# Altium schematic sheet I2C_SENSOR.SchDoc: I2C_SENSOR
size A3; Date: 13/11/2025; DrawnBy: Văn Quý Tuân; SheetNumber: 5; SheetTotal: 10; Subsystem: HW-11/11/25; Size: A3
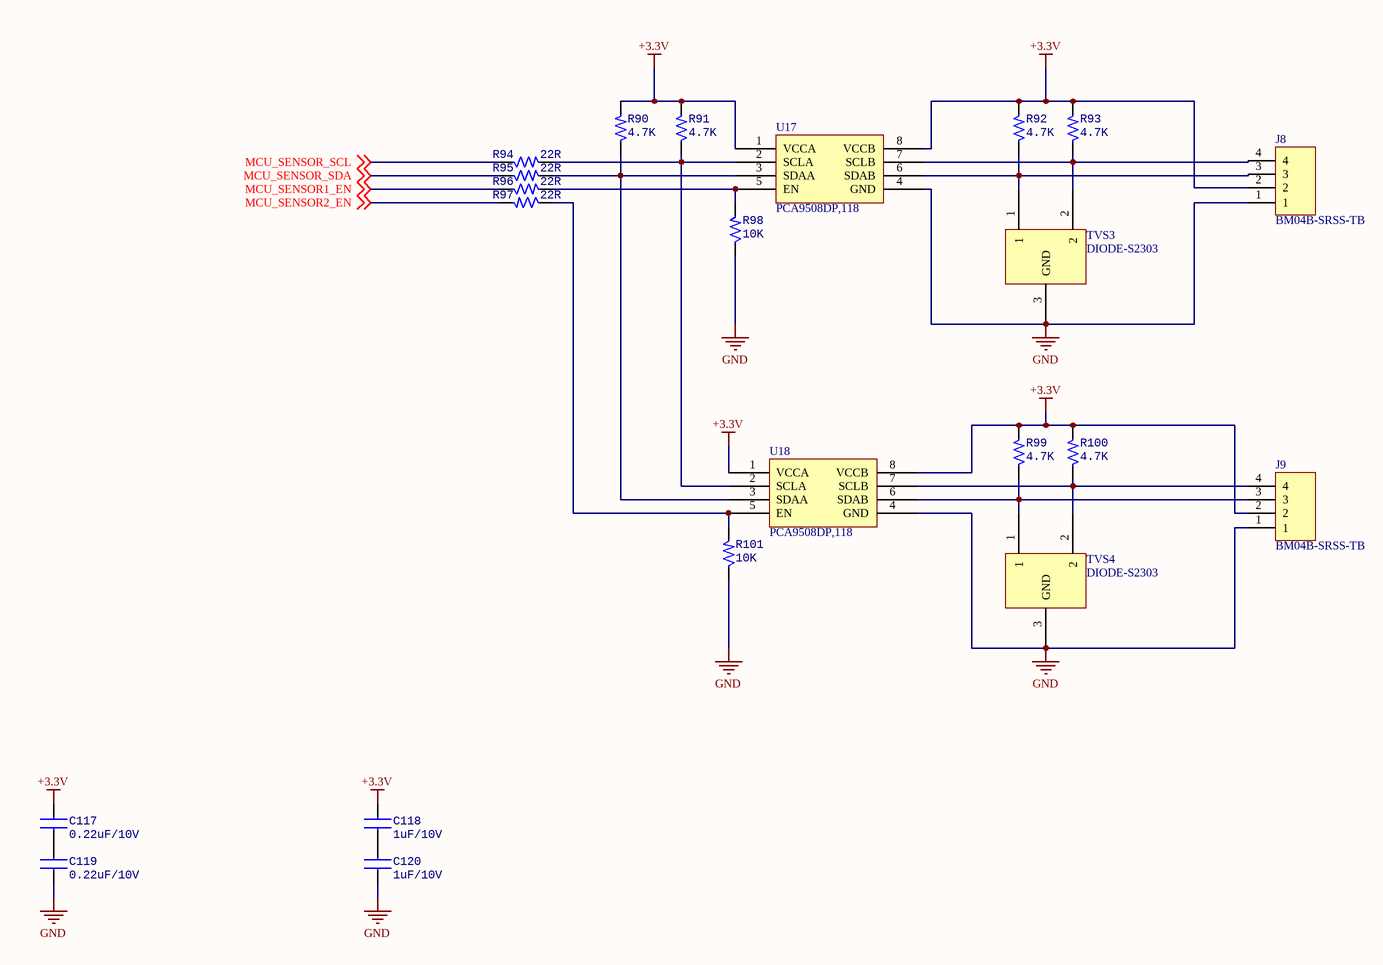
[diagram p0: I2C_SENSOR.SchDoc]

## Parts
C117  0.22uF/10V  [CAP-CER-0603]
C118  1uF/10V  [CAP-CER-0603]
C119  0.22uF/10V  [CAP-CER-0603]
C120  1uF/10V  [CAP-CER-0603]
J8  BM04B-SRSS-TB  [BM04B-SRSS-TB]
J9  BM04B-SRSS-TB  [BM04B-SRSS-TB]
R90  4.7K  [RES-SMD-0603]
R91  4.7K  [RES-SMD-0603]
R92  4.7K  [RES-SMD-0603]
R93  4.7K  [RES-SMD-0603]
R94  22R  [RES-SMD-0603]
R95  22R  [RES-SMD-0603]
R96  22R  [RES-SMD-0603]
R97  22R  [RES-SMD-0603]
R98  10K  [RES-SMD-0603]
R99  4.7K  [RES-SMD-0603]
R100  4.7K  [RES-SMD-0603]
R101  10K  [RES-SMD-0603]
TVS3  DIODE-S2303  [DIODE SOT23]
TVS4  DIODE-S2303  [DIODE SOT23]
U17  PCA9508DP,118  [PCA9508DP,118]
U18  PCA9508DP,118  [PCA9508DP,118]

## Nets
+3.3V: C117.1 C118.1 J8.2 J9.2 R90.2 R91.2 R92.2 R93.2 R99.2 R100.2 U17.1(VCCA) U17.8(VCCB) U18.1(VCCA) U18.8(VCCB)
GND: C119.2 C120.2 J8.1 J9.1 R98.1 R101.1 TVS3.3(GND) TVS4.3(GND) U17.4(GND) U18.4(GND)
MCU_SENSOR1_EN: R96.1 ; off-sheet MCU_SENSOR1_EN
MCU_SENSOR2_EN: R97.2 ; off-sheet MCU_SENSOR2_EN
MCU_SENSOR_SCL: R94.1 ; off-sheet MCU_SENSOR_SCL
MCU_SENSOR_SDA: R95.1 ; off-sheet MCU_SENSOR_SDA
NetC117_2: C117.2 C119.1
NetC118_2: C118.2 C120.1
NetJ8_3: J8.3 R92.1 TVS3.1 U17.6(SDAB)
NetJ8_4: J8.4 R93.1 TVS3.2 U17.7(SCLB)
NetJ9_3: J9.3 R99.1 TVS4.1 U18.6(SDAB)
NetJ9_4: J9.4 R100.1 TVS4.2 U18.7(SCLB)
NetR90_1: R90.1 R95.2 U17.3(SDAA) U18.3(SDAA)
NetR91_1: R91.1 R94.2 U17.2(SCLA) U18.2(SCLA)
NetR96_2: R96.2 R98.2 U17.5(EN)
NetR97_1: R97.1 R101.2 U18.5(EN)

## Notes on the sheet
- Project:
- Sub-system:
- Checked by:
- Design by:
- Sheet title:
- Doc no:
- Sheet
- Size
- Approved by:
- Revision:
- Date
- Text

## Library data of the parts
C117-C120 = CAP-CER
J8 J9 = CON-PLG_4X1-50-RA-SMD: 4 Pins, 1 Row 1.25mm Pitch, right angle Connector, male; Manufacturer: WE; Manufacturer Part Number: 653104131822; Mating Part Number: 653004113322; Crimp Part Number: 65300113722DEC; Alternate Part Number-1: NA; Case/Package: TH-CON; Supplier-1: WURTH; Supplier Part Number-1: 653104131822
R90-R101 = RES-SMD